# EAGLE schematic untitled (EAGLE 9.6.2)
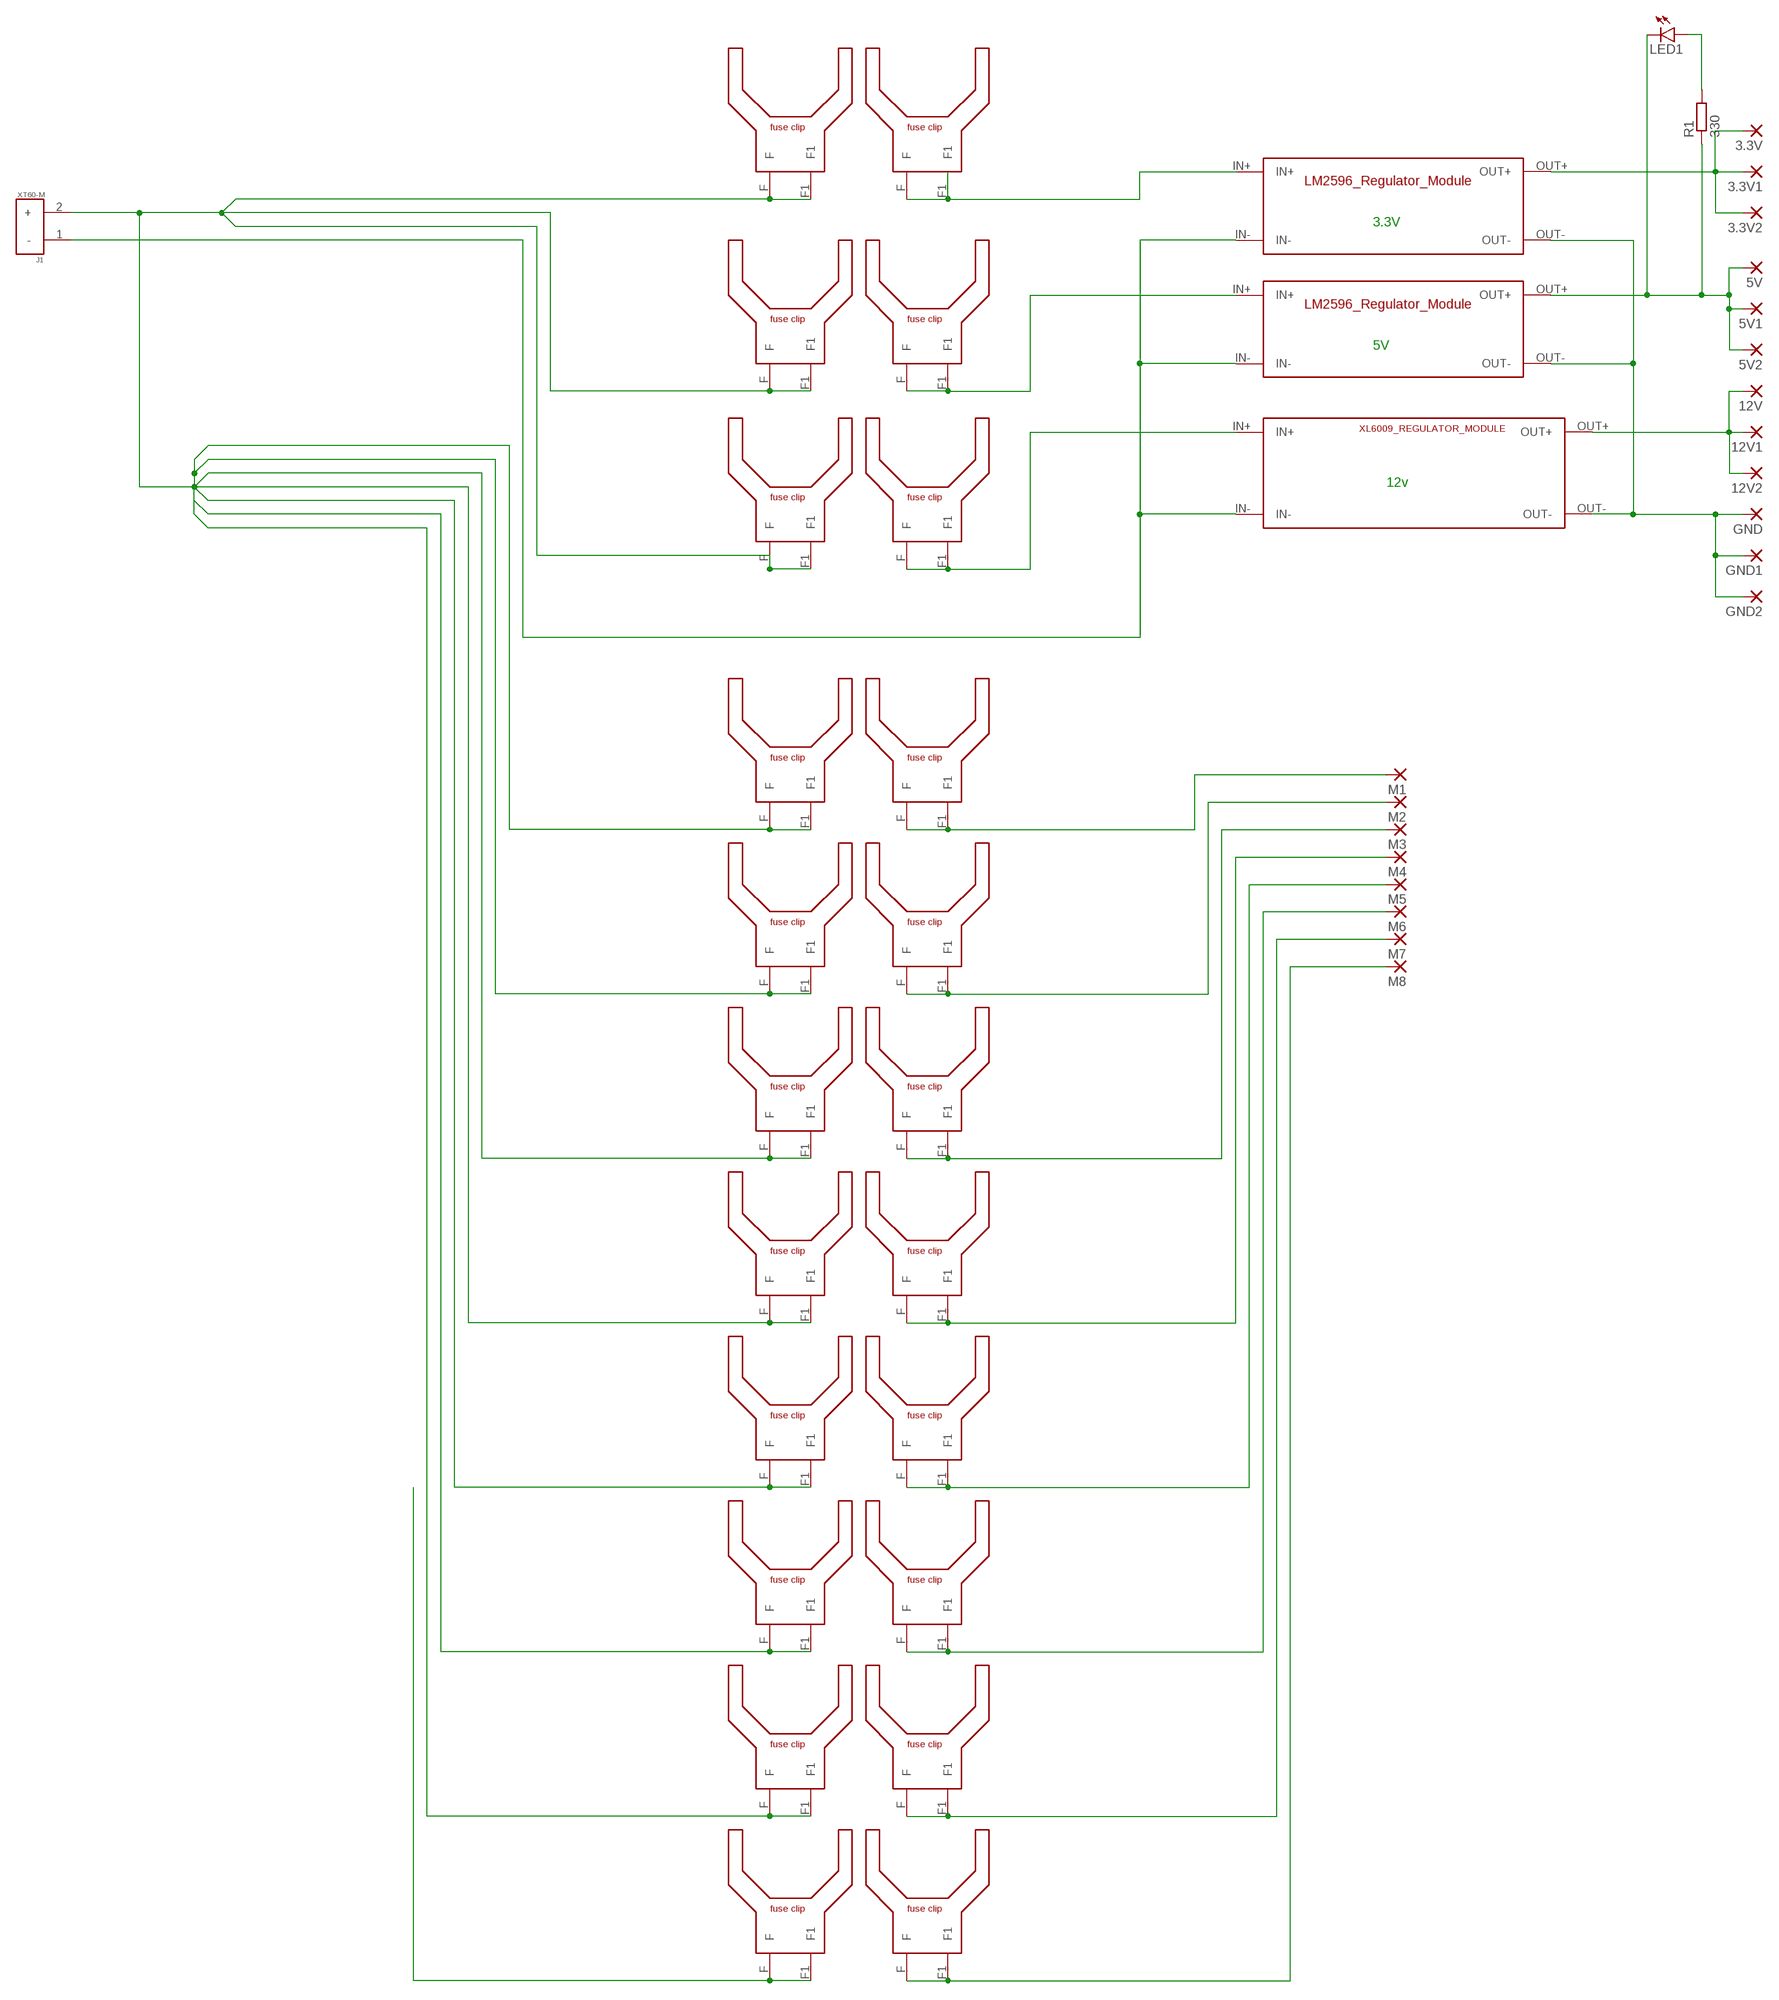
[diagram p0: schematic, sheet 1]

## Parts
3.3V  SMD5  [SMD2,54-5,08]
3.3V1  SMD5  [SMD2,54-5,08]
3.3V2  SMD5  [SMD2,54-5,08]
5V  SMD5  [SMD2,54-5,08]
5V1  SMD5  [SMD2,54-5,08]
5V2  SMD5  [SMD2,54-5,08]
12V  SMD5  [SMD2,54-5,08]
12V1  SMD5  [SMD2,54-5,08]
12V2  SMD5  [SMD2,54-5,08]
GND  SMD5  [SMD2,54-5,08]
GND1  SMD5  [SMD2,54-5,08]
GND2  SMD5  [SMD2,54-5,08]
J1  XT60-M  [AMASS_XT60-M]
LED1  LED5MM  [LED5MM]
M1  SMD5  [SMD2,54-5,08]
M2  SMD5  [SMD2,54-5,08]
M3  SMD5  [SMD2,54-5,08]
M4  SMD5  [SMD2,54-5,08]
M5  SMD5  [SMD2,54-5,08]
M6  SMD5  [SMD2,54-5,08]
M7  SMD5  [SMD2,54-5,08]
M8  SMD5  [SMD2,54-5,08]
R1  330  R-EU_0207/10  [0207/10]
U$1  LM2596_MODULE  [LM2596_MODULE]
U$2  LM2596_MODULE  [LM2596_MODULE]
U$3  XL6009_MODULE  [XL6009_MODULE]
U$4  FUSE_HOLDER  [FUSE_HOLDER]
U$5  FUSE_HOLDER  [FUSE_HOLDER]
U$6  FUSE_HOLDER  [FUSE_HOLDER]
U$7  FUSE_HOLDER  [FUSE_HOLDER]
U$8  FUSE_HOLDER  [FUSE_HOLDER]
U$9  FUSE_HOLDER  [FUSE_HOLDER]
U$10  FUSE_HOLDER  [FUSE_HOLDER]
U$11  FUSE_HOLDER  [FUSE_HOLDER]
U$12  FUSE_HOLDER  [FUSE_HOLDER]
U$13  FUSE_HOLDER  [FUSE_HOLDER]
U$14  FUSE_HOLDER  [FUSE_HOLDER]
U$15  FUSE_HOLDER  [FUSE_HOLDER]
U$16  FUSE_HOLDER  [FUSE_HOLDER]
U$17  FUSE_HOLDER  [FUSE_HOLDER]
U$18  FUSE_HOLDER  [FUSE_HOLDER]
U$19  FUSE_HOLDER  [FUSE_HOLDER]
U$20  FUSE_HOLDER  [FUSE_HOLDER]
U$21  FUSE_HOLDER  [FUSE_HOLDER]
U$22  FUSE_HOLDER  [FUSE_HOLDER]
U$23  FUSE_HOLDER  [FUSE_HOLDER]
U$24  FUSE_HOLDER  [FUSE_HOLDER]
U$25  FUSE_HOLDER  [FUSE_HOLDER]

## Nets
N$1: J1.1(-) U$1.IN- U$2.IN- U$3.IN-
N$2: LED1.A R1.2
N$3: U$1.IN+ U$4.F U$4.F1
N$4: U$2.IN+ U$6.F U$6.F1
N$6: U$3.IN+ U$8.F U$8.F1
N$7: J1.2(+) U$5.F U$5.F1 U$7.F U$7.F1 U$9.F U$9.F1 U$10.F U$10.F1 U$12.F U$12.F1 U$14.F U$14.F1 U$16.F U$16.F1 U$18.F U$18.F1 U$20.F U$20.F1 U$22.F U$22.F1
N$9: M1.1(P) U$11.F U$11.F1
N$10: U$24.F U$24.F1
N$11: M8.1(P) U$25.F U$25.F1
N$12: M2.1(P) U$13.F U$13.F1
N$14: M3.1(P) U$15.F U$15.F1
N$17: M4.1(P) U$17.F U$17.F1
N$19: M5.1(P) U$19.F U$19.F1
N$21: M6.1(P) U$21.F U$21.F1
N$23: M7.1(P) U$23.F U$23.F1
N$24: 3.3V1.1(P) 3.3V2.1(P) 3.3V.1(P) U$1.OUT+
N$25: 5V1.1(P) 5V2.1(P) 5V.1(P) LED1.K(C) R1.1 U$2.OUT+
N$26: 12V1.1(P) 12V2.1(P) 12V.1(P) U$3.OUT+
N$27: GND1.1(P) GND2.1(P) GND.1(P) U$1.OUT- U$2.OUT- U$3.OUT-

## Notes on the sheet
- 3.3V
- 5V
- 12v

## Library data of the parts
3.3V 3.3V1 3.3V2 5V 5V1 5V2 12V 12V1 12V2 GND GND1 GND2 M1-M8 = wirepad:SMD5: SMD PAD
J1 = XT60-M:XT60-M: DC supply; XT60; male; PIN:2; for cable; soldered; 60A; 500V Check availability <https://pricing.snapeda.com/parts/XT60-M/AMASS/view-part?ref=eda>; AVAILABILITY: Not in stock; DESCRIPTION: Plug; DC supply; XT60; male; PIN: 2; for cable; soldered; 30A; 500V; MF: AMASS; MP: XT60-M; PACKAGE: Package; PRICE: None
LED1 = led:LED: LED OSRAM: - CHIPLED LG R971, LG N971, LY N971, LG Q971, LY Q971, LO R971, LY R971 LH N974, LH R974 LS Q976, LO Q976, LY Q976 LO Q996 - Hyper CHIPLED LW Q18S LB Q993, LB Q99A, LB R99A - SideLED LS A670, LO A670, LY A670, LG A670, LP A670 LB A673, LV A673, LT A673, LW A673 LH A674 LY A675 LS A676, LA A676, LO A676, LY A676, LW A676 LS A679, LY A679, LG A679 - Hyper Micro SIDELED® LS Y876, LA Y876, LO Y876, LY Y876 LT Y87S - SmartLED LW L88C, LW L88S LB L89C, LB L89S, LG L890 LS L89K, LO L89K, LY L89K LS L896, LA L896, LO L896, LY L896 - TOPLED LS T670, LO T670, LY T670, LG T670, LP T670 LSG T670, LSP T670, LSY T670, LOP T670, LYG T670 LG T671, LOG T671, LSG T671 LB T673, LV T673, LT T673, LW T673 LH T674 LS T676, LA T676, LO T676, LY T676, LB T676, LH T676, LSB T676, LW T676 LB T67C, LV T67C, LT T67C, LS T67K, LO T67K, LY T67K, LW E67C LS E67B, LA E67B, LO E67B, LY E67B, LB E67C, LV E67C, LT E67C LW T67C LS T679, LY T679, LG T679 LS T770, LO T770, LY T770, LG T770, LP T770 LB T773, LV T773, LT T773, LW T773 LH T774 LS E675, LA E675, LY E675, LS T675 LS T776, LA T776, LO T776, LY T776, LB T776 LHGB T686 LT T68C, LB T68C - Hyper Mini TOPLED® LB M676 - Mini TOPLED Santana® LG M470 LS M47K, LO M47K, LY M47K Source: http://www.osram.convergy.de LUXEON: - LUMILED® LXK2-PW12-R00, LXK2-PW12-S00, LXK2-PW14-U00, LXK2-PW14-V00 LXK2-PM12-R00, LXK2-PM12-S00, LXK2-PM14-U00 LXK2-PE12-Q00, LXK2-PE12-R00, LXK2-PE12-S00, LXK2-PE14-T00, LXK2-PE14-U00 LXK2-PB12-K00, LXK2-PB12-L00, LXK2-PB12-M00, LXK2-PB14-N00, LXK2-PB14-P00, LXK2-PB14-Q00 LXK2-PR12-L00, LXK2-PR12-M00, LXK2-PR14-Q00, LXK2-PR14-R00 LXK2-PD12-Q00, LXK2-PD12-R00, LXK2-PD12-S00 LXK2-PH12-R00, LXK2-PH12-S00 LXK2-PL12-P00, LXK2-PL12-Q00, LXK2-PL12-R00 Source: www.luxeon.com KINGBRIGHT: KA-3528ASYC Source: www.kingbright.com
R1 = rcl:R-EU_: RESISTOR, European symbol; SPICEPREFIX: R
U$1 U$2 = power_dist:LM2596_MODULE
U$3 = power_dist:XL6009_MODULE
U$4-U$25 = power_dist:FUSE_HOLDER